# EAGLE design XCOMBO (EAGLE 8.3.1)
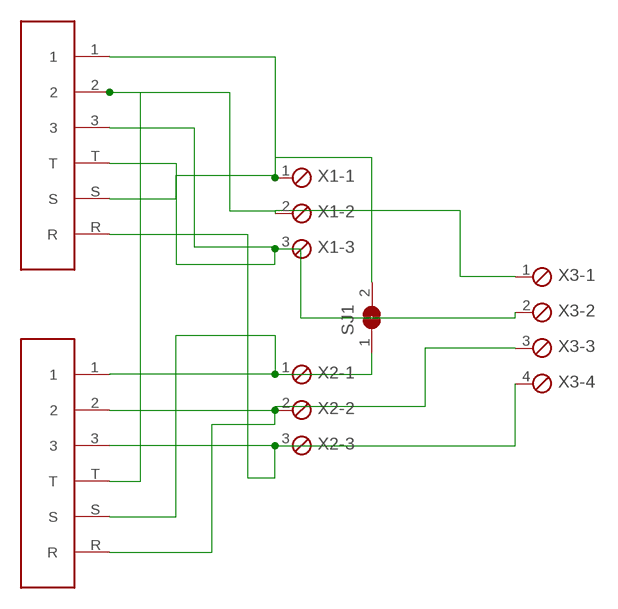
[diagram p0: schematic, sheet 1]

## Parts
SJ1  SJ  [SJ]
U$1  XLRCOMBO  [NCJ6FI-S-0]
U$2  XLRCOMBO  [NCJ6FI-S-0]
X1  MPT3  [3POL254]
X2  MPT3  [3POL254]
X3  MPT4  [4POL254]

## Nets
L+: U$1.T U$2.2 X1.2 X3.1
L-: U$2.3 U$2.T X1.3 X3.2
LG: SJ1.2 U$2.1 U$2.S X1.1
R+: U$1.2 U$1.R X2.2 X3.3
R-: U$1.3 U$2.R X2.3 X3.4
RG: SJ1.1 U$1.1 U$1.S X2.1

## Library data of the parts
SJ1 = jumper:SJ: SMD solder JUMPER
U$1 U$2 = Vwvwbg:XLRCOMBO
X1 X2 = con-phoenix-254:MPT3: PHOENIX CONNECTOR; OC_FARNELL: unknown; OC_NEWARK: unknown
X3 = con-phoenix-254:MPT4: PHOENIX CONNECTOR; OC_FARNELL: unknown; OC_NEWARK: unknown

## Board
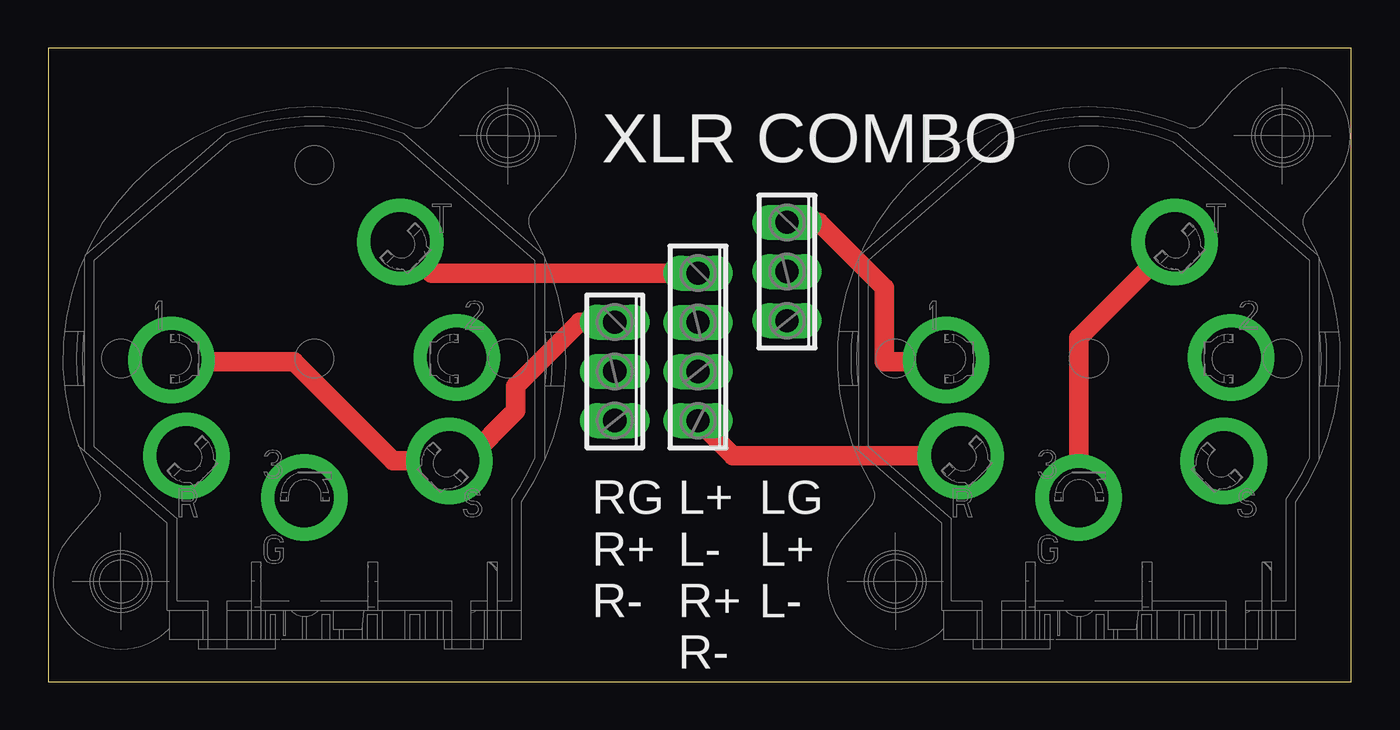
[diagram p1: board, top side]
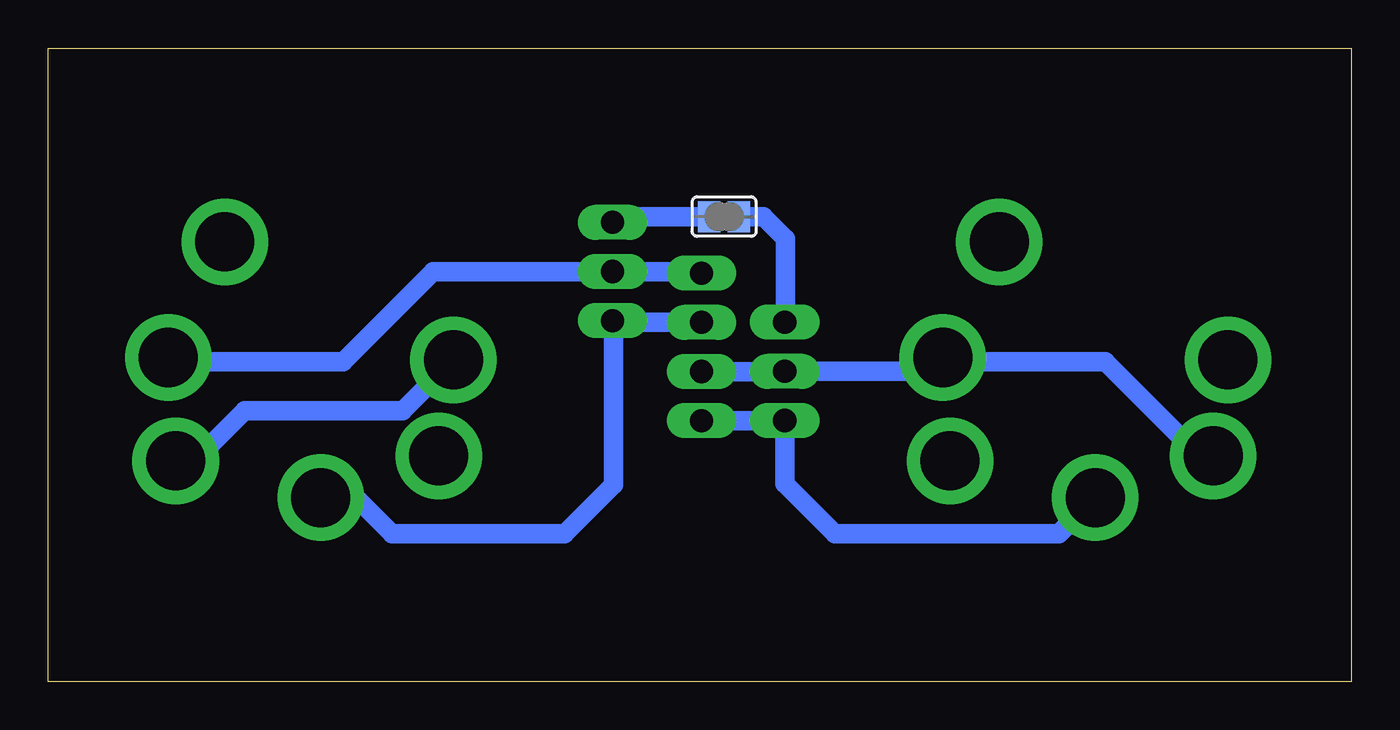
[diagram p2: board, bottom side, seen from below]

Size 67.29 x 32.69 mm. Coordinates in mm from the lower left corner, seen from the top.
Outline: 0,0 67.29,0 67.29,32.69 0,32.69 0,0
Copper layers (1*16): Top 0.035mm / dielectric 1.5mm / Bottom 0.035mm
Design rules "default": minimum track width 6mil, minimum drill 0.3mm, track to track 7mil, track to pad 7mil, pad to pad 7mil, via to via 7mil, smd to smd 7mil, copper to edge 8mil, drill to drill 8mil, minimum pad ring 6mil, minimum via ring 6mil, stop-mask expansion 4mil, vias tented up to drill 0mil, thermal gap 10mil

### Footprints (pad centres in the part's own frame; a part is rotated, then mirrored left to right if it is on the bottom)
SJ = smd 1.168 x 1.6: 1 -0.762,0; 2 0.762,0
NCJ6FI-S-0 = drill 3.048 pad 4.47: 1 -7.366,-0.127; 2 7.366,0; 3 -0.508,-7.239; R -6.604,-5.08; S 6.985,-5.334; T 4.445,5.969
3POL254 = drill 1.2 long: 1 -2.54,0; 2 0,0; 3 2.54,0
4POL254 = drill 1.2 long: 1 -3.81,0; 2 -1.27,0; 3 1.27,0; 4 3.81,0

### Placement (x,y rotation side)
SJ1  32.38,24 180 bottom
U$1  13.73,16.73 0 top
U$2  53.73,16.73 0 top
X1  38.15,21.17 270 top
X2  29.25,16.02 270 top
X3  33.55,17.28 270 top

### Tracks (layer width: path | path; a pad name or v marks a point on that pad's centre or on a via)
L+
  Top 1.016: X3.1 19.79,21.09 U$1.T
  Bottom 1.016: X3.1 33.63,21.17 X1.2 47.41,21.17 52.07,16.51 60.88,16.51 U$2.2
L-
  Top 1.016: U$2.3 53.22,17.75 U$2.T
  Bottom 1.016: X3.2 38.07,18.55 X1.3 38.1,18.58 38.1,10.16 40.64,7.62 49.53,7.62 51.4,9.49 U$2.3
LG
  Top 1.016: X1.1 39.79,23.71 43.18,20.32 43.18,16.51 46.27,16.51 U$2.1
  Bottom 1.016: SJ1.2 37.86,24 X1.1 | U$2.S 59.72,11.4 57.15,13.97 49,13.97 U$2.1
R+
  Bottom 1.016: X3.3 29.26,16.01 X2.2 21.81,16.02 U$1.2 20.88,16.51 12.7,16.51 7.84,11.65 U$1.R
R-
  Top 1.016: U$2.R 35.37,11.65 X3.4
  Bottom 1.016: X3.4 29.26,13.47 X2.3 29.25,10.2 26.67,7.62 15.09,7.62 U$1.3
RG
  Top 1.016: X2.1 27.45,18.56 24.13,15.24 24.13,13.97 21.59,11.43 20.75,11.43 U$1.S 17.81,11.4 12.7,16.51 6.46,16.51 U$1.1
  Bottom 1.016: SJ1.1 30.35,24 29.21,22.86 29.21,18.6 X2.1

### Text on the board
tPlace: XLR COMBO | RG / R+ / R- | LG / L+ / L- | L+ / L- / R+ / R-